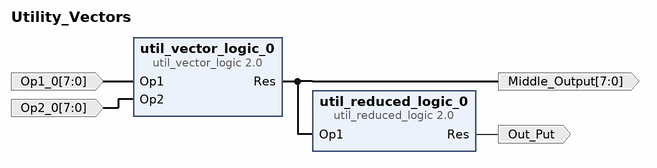
[diagram p0: block diagram of the top level]
# Vivado block design Utility_Vectors, xc7a100tcsg324-1, Vivado 2018.2
create_bd_design Utility_Vectors

create_bd_port -dir O Out_Put
create_bd_port -dir I -from 7 -to 0 Op1_0
create_bd_port -dir I -from 7 -to 0 Op2_0
create_bd_port -dir O -from 7 -to 0 -type data Middle_Output

create_bd_cell -type ip -vlnv xilinx.com:ip:util_vector_logic:2.0 util_vector_logic_0
create_bd_cell -type ip -vlnv xilinx.com:ip:util_reduced_logic:2.0 util_reduced_logic_0

# ---- connections ----

connect_bd_net [get_bd_pins util_vector_logic_0/Res] [get_bd_pins util_reduced_logic_0/Op1] [get_bd_ports Middle_Output]
connect_bd_net [get_bd_pins util_reduced_logic_0/Res] [get_bd_ports Out_Put]
connect_bd_net -net Op1_0_1 [get_bd_ports Op1_0] [get_bd_pins util_vector_logic_0/Op1]
connect_bd_net -net Op2_0_1 [get_bd_ports Op2_0] [get_bd_pins util_vector_logic_0/Op2]

validate_bd_design
save_bd_design
